# EasyEDA Pro project PBMCU_C_Hall.epro, board PCB1_2
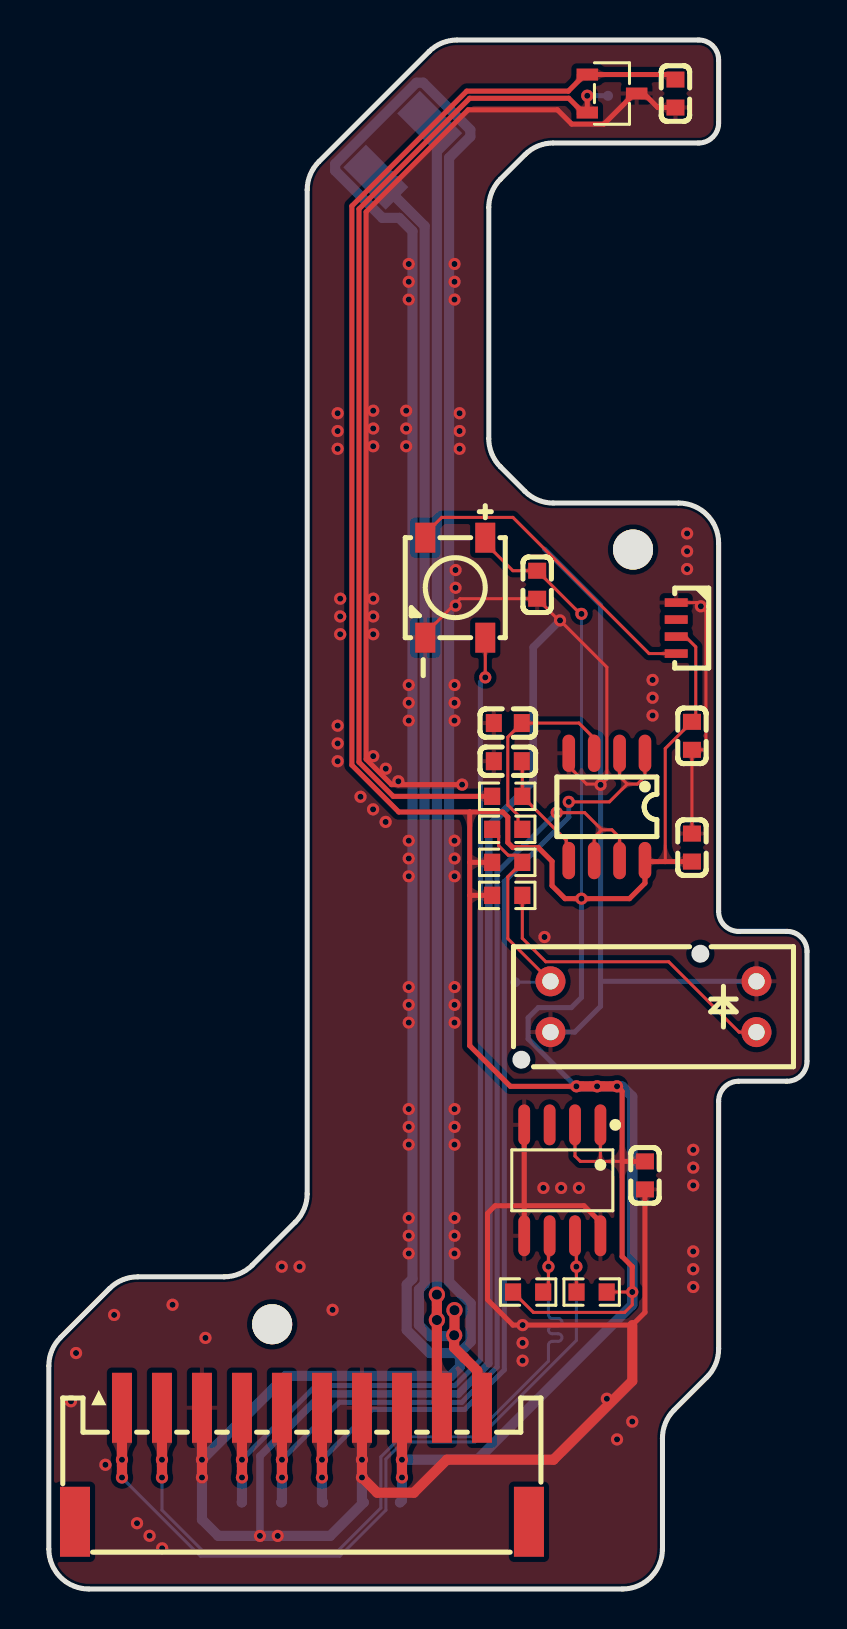
[diagram p6: board, top side]
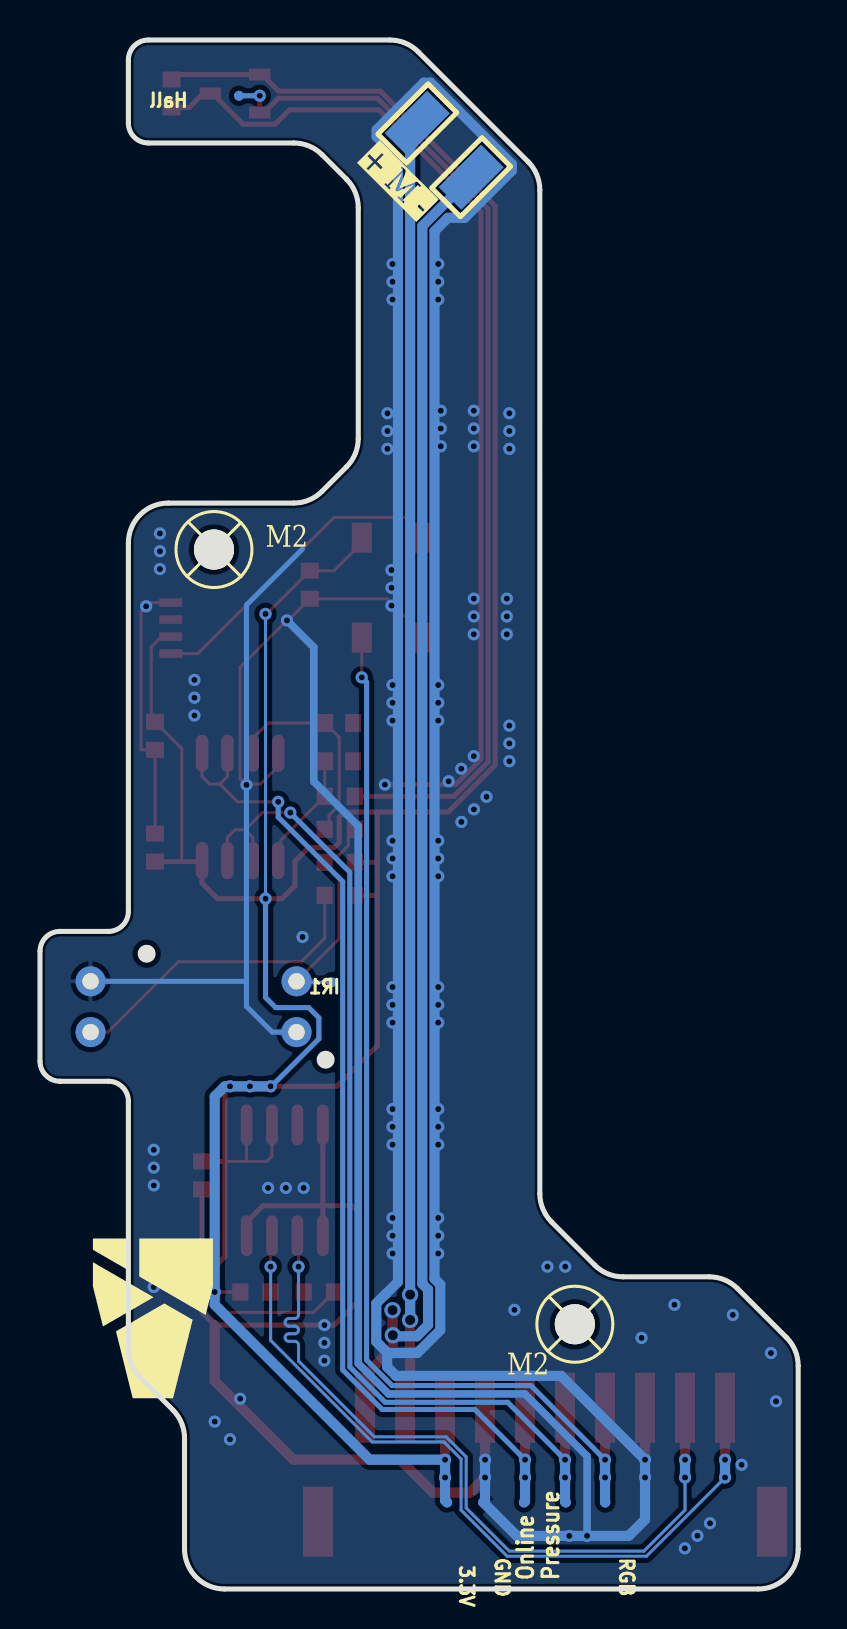
[diagram p7: board, bottom side, seen from below]

Outline 37.91 x 77.45 mm; copper layers: Top Layer, Bottom Layer. Coordinates in mm from the lower left corner of the outline.
Outline path: 0,11.16 0,2 arc(0.59,0.59) 2,0 28.68,0 arc(30.1,0.59) 30.68,2 30.68,7.54 arc(30.84,8.31) 31.27,8.96 32.91,10.59 arc(33.34,11.24) 33.49,12.01 33.49,24.39 arc(33.78,25.1) 34.49,25.39 36.91,25.39 arc(37.62,25.68) 37.91,26.39 37.91,31.88 arc(37.62,32.59) 36.91,32.88 34.49,32.88 arc(33.78,33.17) 33.49,33.88 33.49,52.3 arc(32.91,53.71) 31.49,54.3 25.22,54.3 arc(24.46,54.45) 23.81,54.88 22.58,56.11 arc(22.15,56.76) 22,57.52 22,69.08 arc(22.15,69.84) 22.58,70.49 23.81,71.72 arc(24.46,72.15) 25.22,72.3 32.49,72.3 arc(33.2,72.6) 33.49,73.3 33.49,76.45 arc(33.2,77.16) 32.49,77.45 20.42,77.45 arc(19.65,77.3) 19,76.87 13.5,71.37 arc(13.07,70.72) 12.92,69.95 12.92,19.77 arc(12.77,19) 12.33,18.35 10.18,16.2 arc(9.53,15.76) 8.76,15.61 4.45,15.61 arc(3.68,15.46) 3.03,15.02 0.59,12.57 arc(0.15,11.93) 0,11.16
Stack: Top Layer 0.035mm / Dielectric1 1.51mm FR4 er 4.5 / Bottom Layer 0.035mm

## Design rules (mm)
template: JLCPCB Capability(Two Layers Board)
spacing copperThickness1oz (default): track to track 0.102, other pairs 0.152 to 0.3
spacing copperThickness2oz: track to track 0.203, other pairs 0.152 to 0.3
track width copperThickness1oz (default): min 0.127, default 0.254, max 2.54
track width copperThickness2oz: min 0.203, default 0.254, max 2.54
differential pair differentialPair (default): width min 0.127, default 0.254, max 2.54; gap min 0.152, default 0.152
via viaSize (default): diameter min 0.5, default 0.61, max 10; hole min 0.3, default 0.305, max 6.3

## Placement (name value [footprint] x y rotation side)
3.3V  -  [Test-Point-0.5mm#2]  17.56 4.33 180 bottom
C6  100nF  [C0603]  29.81 20.68 90 top
C7  100nF  [C0603]  24.42 50.22 90 top
C8  100nF  [C0603]  32.16 37.07 270 top
C9  100nF  [C0603]  32.16 42.66 90 top
C10  100nF  [C0603]  31.33 74.78 90 top
C11  100nF  [C0603]  22.95 41.39 0 top
C12  100nF  [C0603]  22.95 43.3 0 top
CN2  2.0-10P WT  [CONN-SMD_10P-P2.00_2.0-10P-WT]  12.66 6.21 0 top
GND  -  [Test-Point-0.5mm#2]  15.74 4.33 180 bottom
Hall  -  [Test-Point-0.5mm]  27.96 74.66 180 top
IR1  -  [Test-Point-0.5mm]  23.32 30.34 0 top
LED1  XL-5050RGBC-WS2812B  [LED-SMD_4P-L5.0-W5.0-BL_XL-5050RGBC]  20.32 50.07 180 top
LED2  XL-4020RGBC-WS2812B  [LED-SMD_4P-L4.0-W1.7_XL-4020RGBC-WS2812B]  31.37 48.05 90 top
Online  -  [Test-Point-0.5mm#2]  13.71 4.33 180 bottom
Pressure  -  [Test-Point-0.5mm#2]  11.62 4.33 90 bottom
R1  470Ω  [R0603]  22.92 34.68 0 top
R2  10kΩ  [R0603]  23.97 14.85 0 top
R3  10kΩ  [R0603]  27.14 14.85 180 top
R4  10kΩ  [R0603]  22.92 36.33 0 top
R5  470Ω  [R0603]  22.92 39.64 0 top
R6  10kΩ  [R0603]  22.92 37.98 180 top
RGB  -  [Test-Point-0.5mm#2]  9.65 4.33 180 bottom
TP1  -  [M2螺丝]  11.17 13.24 180 bottom
TP5  -  [M2螺丝]  29.21 51.97 180 bottom
U1  AS5600  [SOIC-8_L4.9-W3.9-P1.27-LS6.0-BL]  25.68 20.44 180 top
U4  1625854-2  [TEST-RING]  19.04 73.29 135 bottom
U5  1625854-2  [TEST-RING]  16.35 70.59 135 bottom
U7  ITR9606  [OPTO-TH_4P_ITR9606]  30.23 29.12 180 top
U9  OH49E-S  [SOT-23-3_L2.9-W1.6-P1.90-LS2.8-BR]  28.16 74.78 180 top
U10  LMV358  [SOP-8_L4.9-W3.9-P1.27-LS6.0-BL]  27.9 39.1 180 top

## Footprints (pads in the part's own frame, mm; a bottom-side part is the same pattern mirrored in y, then rotated)
C0603
  rect 0.8x0.9 smd: 1(-0.7,0) 2(0.7,0)
CONN-SMD_10P-P2.00_2.0-10P-WT
  rect 1x3.5 smd: 1(-9,2.85) 2(-7,2.85) 3(-5,2.85) 4(-3,2.85) 5(-1,2.85) 6(1,2.85) 7(3,2.85) 8(5,2.85) 9(7,2.85) 10(9,2.85)
  rect 1.5x3.5 smd: 11(11.35,-2.85) 12(-11.35,-2.85)
LED-SMD_4P-L4.0-W1.7_XL-4020RGBC-WS2812B
  rect 0.43x1.15 smd: 1(1.275,0) 2(0.425,0) 3(-0.425,0) 4(-1.275,0)
LED-SMD_4P-L5.0-W5.0-BL_XL-5050RGBC
  rect 1x1.5 smd: 1(-1.5,-2.5) 2(1.5,-2.5) 3(1.5,2.5) 4(-1.5,2.5)
M2螺丝
  round 2 hole 2: 1(0,0)
OPTO-TH_4P_ITR9606
  round 1.5 hole 0.818x0.813: 1(-5.15,1.27) 2(-5.15,-1.27) 3(5.15,-1.27) 4(5.15,1.27)
R0603
  rect 0.806x0.864 smd: 1(-0.753,0) 2(0.753,0)
SOIC-8_L4.9-W3.9-P1.27-LS6.0-BL
  oval 0.588x2.045 smd: 1(-1.905,-2.772) 2(-0.635,-2.772) 3(0.635,-2.772) 4(1.905,-2.772) 5(1.905,2.772) 6(0.635,2.772) 7(-0.635,2.772) 8(-1.905,2.772)
SOP-8_L4.9-W3.9-P1.27-LS6.0-BL
  oval 0.63x1.865 smd: 1(-1.905,-2.683) 2(-0.635,-2.683) 3(0.635,-2.683) 4(1.905,-2.683) 5(1.905,2.683) 6(0.635,2.683) 7(-0.635,2.683) 8(-1.905,2.683)
SOT-23-3_L2.9-W1.6-P1.90-LS2.8-BR
  rect 1.07x0.6 smd: 1(1.235,-0.95) 2(1.235,0.95) 3(-1.235,0)
Test-Point-0.5mm
  round 0.5 smd far side: 1(0,0)
Test-Point-0.5mm#2
  round 0.5 smd: 1(0,0)
TEST-RING
  rect 3x1.6 smd: 1(0,0)

## Nets
As in the schematic.

Pads without a net: CN2 11 12; LED2 2; TP1 1; TP5 1; U1 3

## Via types
v1: diameter 0.61, hole 0.305, Top Layer to Bottom Layer, 134 vias
v2: diameter 0.813, hole 0.508, Top Layer to Bottom Layer, 4 vias

## Routing (per net, layer and track width the routed paths; a pad name or vN(x,y) marks a point on that pad's centre or on a via; arc(x,y) is an arc through that point)
3.3V: length 197.4
  Top Layer w0.152: LED2.3 31.83,47.62 32.35,47.11 32.35,43.55 C9.2 30.82,42.02 30.82,36.37 ; 27.58,21.38 26.58,21.38 26.31,21.65 U1.2 ; 27.58,21.38 U1.1 ; 27.58,21.38 28.67,21.38 ; R2.1 24.23,13.83 28.79,13.83 29.17,14.21 v1(29.17,14.85) 27.9,14.85 R3.1 ; LED1.1 21.82,52.3 23.2,50.92 C7.2 26.58,48.76 v1(26.63,48.76) ; 29.86,36.37 U10.8
  Top Layer w0.254: C8.2 29.86,36.37 ; 21.05,36.33 21.05,38.85 ; 21.05,36.33 21.05,34.68 ; 21.05,36.33 R4.1 ; 21.05,38.85 22.7,38.85 22.95,38.6 22.95,37.33 23.2,37.07 24.47,37.07 25.16,36.38 25.16,35.17 25.81,34.52 v1(26.63,34.52) 29.03,34.52 29.81,35.29 U10.8 ; 21.05,38.85 17.5,38.85 15.15,41.2 15.15,69.15 20.9,74.9 25.98,74.9 26.81,75.73 U9.1 31.08,75.73 C10.2 ; v1(29.17,14.85) 29.17,16.12 28.67,16.62 28.67,21.38 ; 28.67,21.38 C6.2 ; 28.67,21.38 28.67,24.88 v1(28.41,25.13) ; v1(26.38,25.13) 23.08,25.13 21.05,27.17 21.05,34.68 ; R1.1 21.05,34.68
  Top Layer w0.508: v1(17.66,5.58) v1(17.66,6.47) CN2.8 ; v1(26.38,25.13) v1(27.42,25.13) v1(28.41,25.13)
  Bottom Layer w0.152: v1(26.63,48.76) v1(26.63,34.52)
  Bottom Layer w0.254: v1(26.63,34.52) 26.63,29.58 26.13,29.07 24.47,29.07 23.97,28.56 23.97,27.51 26.34,25.13
  Bottom Layer w0.508: 3.3V.1 17.66,4.43 v1(17.66,5.58) v1(17.66,6.47) 21.43,6.47 29.17,14.21 v1(29.17,14.85) 29.17,24.63 28.67,25.13 v1(28.41,25.13) v1(27.42,25.13) v1(26.38,25.13)
GND: length 398.4
  Top Layer w0.152: C8.1 C9.1 32.86,41.96 32.86,48.88 32.42,49.32 LED2.1 ; U10.4 26,41.14 26.89,40.25 27.65,40.25 27.9,40.5 27.9,46.09 v1(25.56,48.43) 25.5,48.43 C7.1 20.56,49.52 18.82,47.78 LED1.3
  Top Layer w0.254: C10.1 30.45,74.08 29.75,74.78 U9.3 29.28,74.78 27.76,73.25 26.15,73.25 25.43,73.96 20.97,73.96 15.86,68.86 15.86,41.49 17.14,40.22 v1(20.66,40.22) ; 23.77,19.17 U1.4 ; 23.77,19.17 26.76,19.17 27.58,18.34 U1.8 ; 23.77,19.17 U1.5 ; 23.77,19.17 22.32,19.17 21.94,18.78 21.94,14.47 23.2,13.2 v1(23.69,13.2) 29.17,13.2 29.81,13.83 C6.1
  Top Layer w0.508: CN2.7 v1(15.66,6.47) v1(15.66,5.58) 16.42,4.81 18.25,4.81 19.9,6.47 25.24,6.47 29.17,10.4 29.17,13.2 ; CN2.3 v1(7.66,6.47) v1(7.66,5.58)
  Bottom Layer w0.254: U7.2 27.59,30.39 ; 27.59,30.39 27.59,29.14 26.3,27.85 U7.4 ; 27.59,30.39 v1(27.59,40.21) 27.59,49.2 24.79,51.99
  Bottom Layer w0.381: v1(25.56,48.43) 24.22,47.09 24.22,40.37 22,38.15 22,11.28 20.48,9.75 13.67,9.75 10.56,6.64 v1(10.56,2.66)
  Bottom Layer w0.508: 20.55,11.82 20.55,11.1 20.1,10.66 11.85,10.66 v1(7.66,6.47) v1(7.66,5.58) 7.66,3.47 8.47,2.66 v1(10.56,2.66) v1(11.45,2.66) 14.07,2.66 GND.1 15.66,4.42 v1(15.66,5.58) v1(15.66,6.47) ; 20.55,11.82 21.1,12.37 21.1,14.28 20.62,14.75 20.61,14.75 20.01,15.36 20.01,71.56 21.08,72.62 21.08,72.96 18.72,75.32 18.38,75.32 14.32,71.25 14.32,70.92 16.68,68.56 17.52,68.56 18.18,67.9 18.18,15.51 17.9,15.22 17.9,12.95 19.04,11.8 20.53,11.8 20.55,11.82
  vias: v1(1.11,9.39) v1(1.36,11.8) v1(2.83,6.21) v1(3.27,13.7) v1(4.41,3.29) v1(5.04,2.66) v1(5.67,2.03) v1(6.19,14.21) v1(7.83,12.55) v1(11.65,16.12) v1(12.54,16.12) v1(14.19,13.96) v1(14.44,58.79) v1(14.44,57.9) v1(14.44,57.01) v1(14.44,43.17) v1(14.44,42.28) v1(14.44,41.39) v1(14.57,49.52) v1(14.57,48.63) v1(14.57,47.74) v1(15.59,39.61) v1(16.22,58.92) v1(16.22,58.03) v1(16.22,57.14) v1(16.22,49.52) v1(16.22,48.63) v1(16.22,47.74) v1(16.22,41.64) v1(16.21,38.98) v1(16.85,41.02) v1(16.84,38.36) v1(17.48,40.39) v1(17.87,58.92) v1(17.87,58.03) v1(17.87,57.14) v1(18,66.25) v1(18,65.36) v1(18,64.47) v1(18,45.2) v1(18,44.31) v1(18,43.42) v1(18,37.42) v1(18,36.53) v1(18,35.64) v1(18,30.1) v1(18,29.21) v1(18,28.32) v1(18,24) v1(18,23.11) v1(18,22.22) v1(18,18.55) v1(18,17.67) v1(18,16.78) v1(20.28,66.25) v1(20.28,65.36) v1(20.28,64.47) v1(20.28,45.2) v1(20.28,44.31) v1(20.28,43.42) v1(20.28,37.42) v1(20.28,36.53) v1(20.28,35.64) v1(20.28,30.1) v1(20.28,29.21) v1(20.28,28.32) v1(20.28,24) v1(20.28,23.11) v1(20.28,22.22) v1(20.28,18.55) v1(20.28,17.67) v1(20.28,16.78) v1(20.34,50.95) v1(20.34,50.06) v1(20.34,49.17) v1(20.54,58.79) v1(20.54,57.9) v1(20.54,57.01) v1(23.69,12.31) v1(23.69,11.42) v1(24.78,32.6) v1(24.73,20.05) v1(25.62,20.05) v1(26.51,20.05) v1(27.9,9.51) v1(28.41,7.48) v1(29.17,8.37) v1(30.19,45.45) v1(30.19,44.57) v1(30.19,43.68) v1(31.91,52.78) v1(31.91,51.89) v1(31.91,51) v1(32.22,21.96) v1(32.22,21.07) v1(32.22,20.18) v1(32.22,16.88) v1(32.22,15.99) v1(32.22,15.1) v1(32.6,49.14)
HALL_OUT: length 50.9
  Top Layer w0.254: v1(26.92,74.66) U9.2 26.71,73.83 26,74.54 21.04,74.54 15.51,69 15.51,41.34 17.22,39.64 R5.1
  Bottom Layer w0.254: Hall.1 27.96,74.66 v1(26.92,74.66)
HALL_RC: length 5.9
  Top Layer w0.152: U10.5 25.87,36.55 25.87,37.44 R5.2 23.67,41.37 C11.2
IR1_RC: length 10.6
  Top Layer w0.152: U10.3 27.27,42.53 26.5,43.3 C12.2 22.95,42.6 22.95,39.2 23.46,38.69 23.46,38.2 R6.1
IR1_RECV: length 11.4
  Top Layer w0.152: U7.3 22.95,32.52 22.95,35.61 R4.2 23.32,36.69 22.97,36.69 22.49,37.17 22.49,37.66 R6.2
  Bottom Layer w0.152: IR1.1 25.04,30.34 U7.3
K_ONLINE: length 53.5
  Top Layer w0.152: U10.1 29.81,40.63 29.43,40.25 28.92,40.25 ; 28.92,40.25 28.03,39.36 v1(26,39.36) ; 28.92,40.25 28.54,40.63 U10.2
  Top Layer w0.508: v1(13.66,5.58) v1(13.66,6.47) CN2.6
  Bottom Layer w0.254: v1(26,39.36) 26,38.6 22.77,35.37 22.77,10.95 20.8,8.98 16.17,8.98 v1(13.66,6.47)
  Bottom Layer w0.508: Online.1 13.66,4.38 v1(13.66,5.58) v1(13.66,6.47)
K_PULL: length 53.8
  Top Layer w0.152: 27.65,37.96 27.27,37.58 U10.6 ; 27.65,37.96 26.79,38.82 v1(25.4,38.82) ; 27.65,37.96 28.16,37.96 28.54,37.58 U10.7
  Top Layer w0.508: CN2.5 v1(11.66,6.47) v1(11.66,5.58)
  Bottom Layer w0.254: v1(11.66,6.47) 14.53,9.33 20.65,9.33 22.42,11.1 22.42,35.84 v1(25.4,38.82)
  Bottom Layer w0.508: v1(11.66,6.47) v1(11.66,5.58) 11.66,4.37 Pressure.1
MCU_SCL: length 41.2
  Top Layer w0.152: U1.7 26.38,17.59 v1(26.38,16.12) 26.38,14.86 R3.2
  Top Layer w0.508: v1(3.66,5.58) v1(3.66,6.47) CN2.1
  Bottom Layer w0.152: v1(26.38,16.12) 26.38,12.43 21.3,7.35 17.71,7.35 16.86,6.5 16.86,3.95 14.55,1.64 7.58,1.64 3.66,5.57
  Bottom Layer w0.508: v1(3.66,6.47) v1(3.66,5.58)
MCU_SDA: length 41.3
  Top Layer w0.152: R2.2 24.98,15.11 v1(24.98,16.12) 24.98,17.6 U1.6
  Top Layer w0.508: v1(5.66,5.58) v1(5.66,6.47) CN2.2
  Bottom Layer w0.152: v1(24.98,16.12) 24.98,13.72 arc(25.04,13.58) 25.17,13.53 25.47,13.53 arc(25.66,13.34) 25.47,13.14 25.17,13.14 arc(24.98,12.95) 25.17,12.76 25.47,12.76 arc(25.66,12.57) 25.47,12.38 25.17,12.38 arc(25.04,12.33) 24.98,12.19 24.98,11.4 21.19,7.61 17.6,7.61 16.6,6.61 16.6,4.05 14.44,1.89 7.71,1.89 5.66,3.95 v1(5.66,5.58)
  Bottom Layer w0.508: v1(5.66,6.47) v1(5.66,5.58)
MOTOR_HOUT: length 65.7
  Top Layer w0.508: v2(19.4,14.72) v2(19.4,13.45) 19.4,9.32 CN2.9
  Bottom Layer w0.508: U4.1 19.4,72.93 v2(19.4,14.72) v2(19.4,13.45)
MOTOR_LOUT: length 66
  Top Layer w0.508: 20.78,11.56 20.78,11.55 ; 20.78,11.56 20.27,12.07 v2(20.27,12.69) 20.28,12.7 v2(20.28,13.94) ; 20.78,11.56 21.43,10.91 21.43,9.29 CN2.10
  Bottom Layer w0.508: U5.1 18.79,68.15 18.79,15.26 18.51,14.97 18.51,13.2 19.07,12.64 20.22,12.64 v2(20.27,12.69)
RGB_OUT: length 55.8
  Top Layer w0.152: v1(21.82,45.58) LED1.4
  Top Layer w0.508: v1(9.66,5.58) v1(9.66,6.47) CN2.4
  Bottom Layer w0.254: v1(21.82,45.58) 21.58,45.34 21.58,11.45 20.3,10.17 13.37,10.17 v1(9.66,6.47)
  Bottom Layer w0.508: v1(9.66,6.47) v1(9.66,5.58) 9.66,4.34 RGB.1
$1N10852: length 15.9
  Top Layer w0.152: LED2.4 30.01,46.77 23.2,53.58 19.65,53.58 18.82,52.76 LED1.2
$1N13047: length 15.8
  Top Layer w0.152: R1.2 23.67,32.54 24.85,31.36 31,31.36 34.51,27.85 U7.1

## Copper pours and planes (outline as drawn; the poured copper is in the pictures)
GND on Top Layer: -19.34,83.81 49.49,83.81 49.49,-10.04 -19.34,-10.04
GND on Bottom Layer: -14.13,84.82 43.65,84.82 43.65,-6.23 -14.13,-6.23

Small or netless copper shapes (teardrops, artwork), in the pictures only: 139 on Top Layer, 67 on Bottom Layer

## Text on the board
Bottom Silkscreen Layer: Pressure | Online | M2 | + M -
